# EAGLE design SHIFT_LEFT_RIGHT_1 (EAGLE 6.5.0)

## Sheet 1 of 4
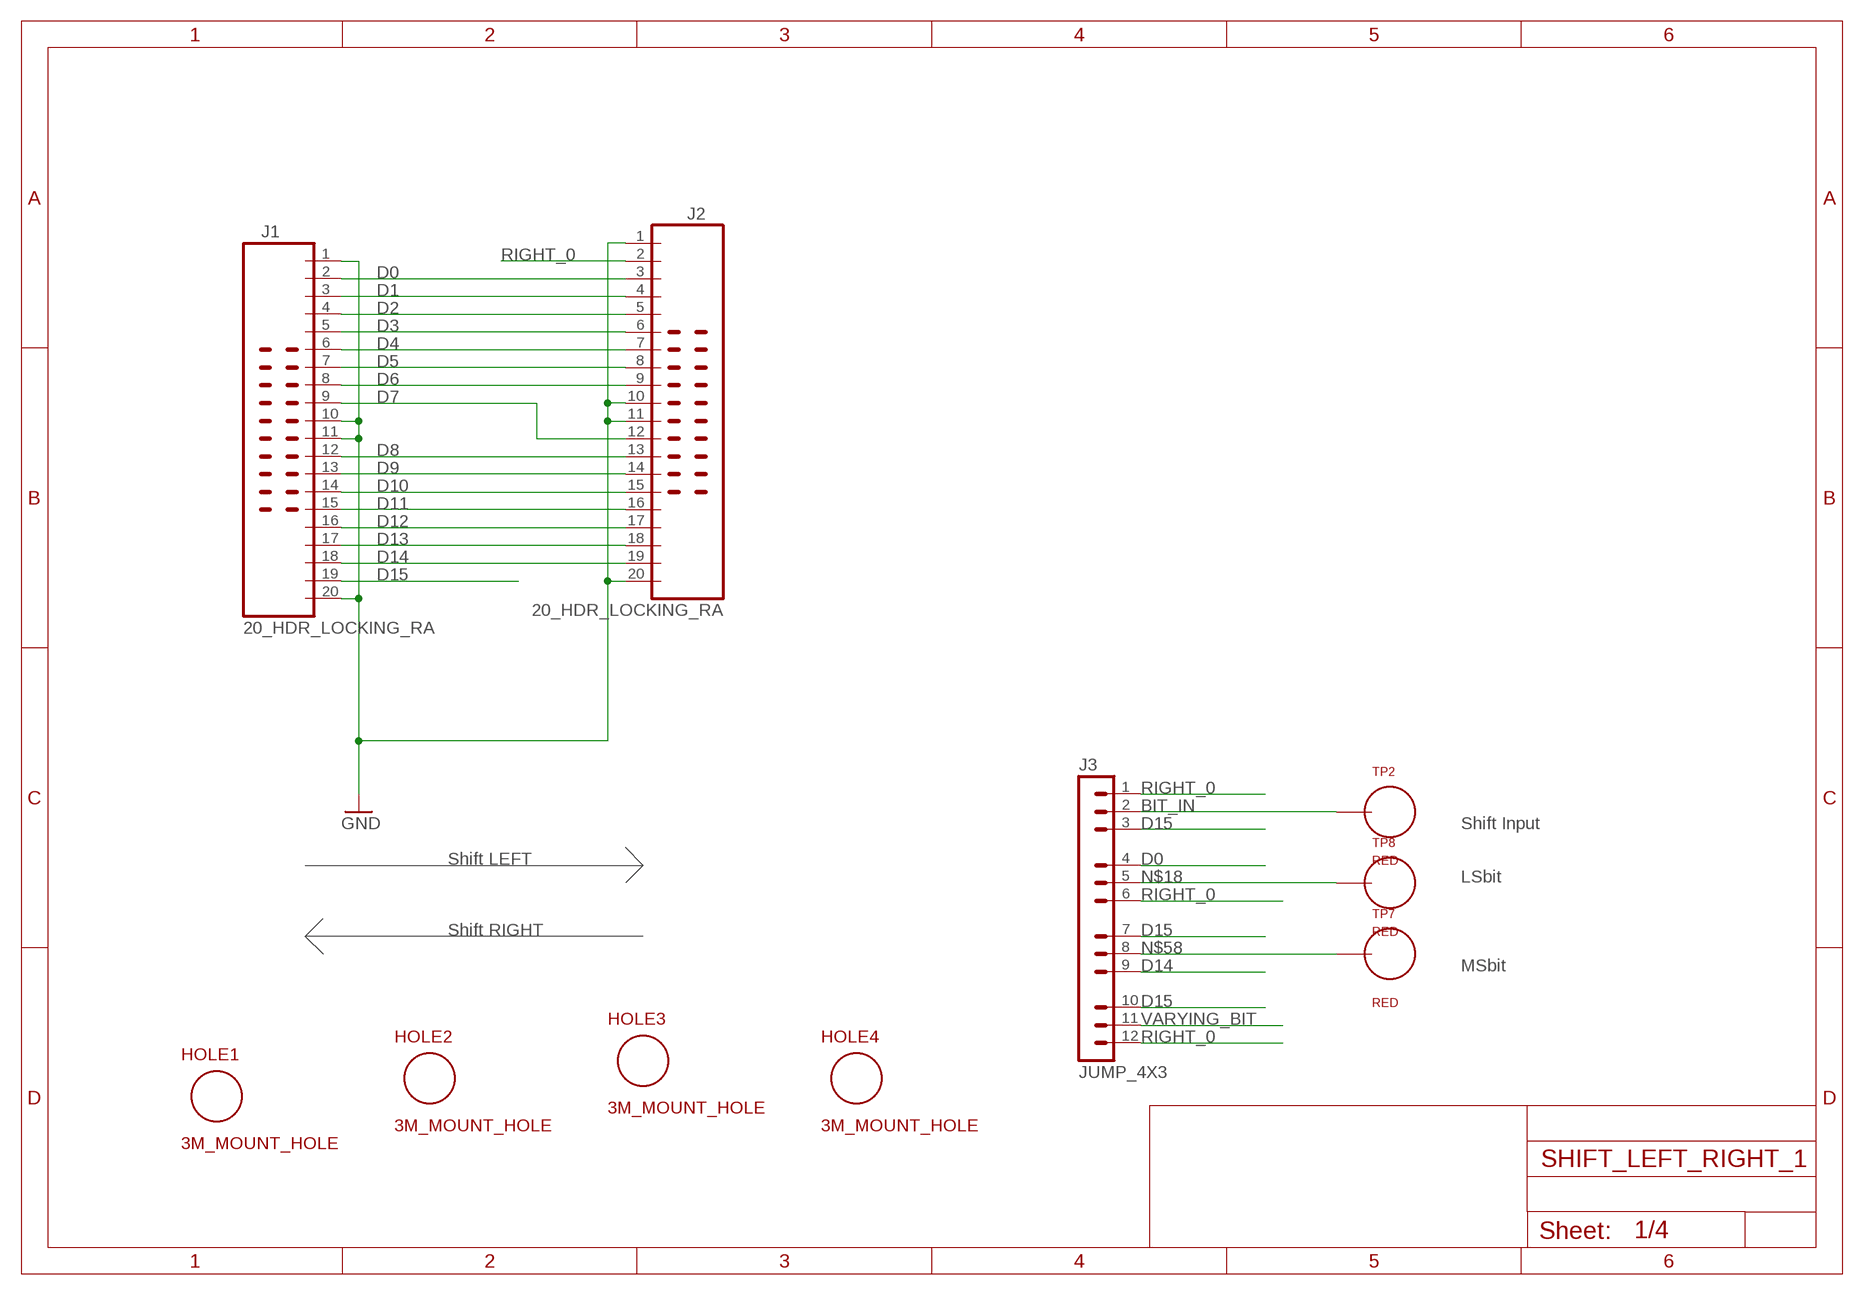
[diagram p0: schematic, sheet 1]

### Parts
HOLE1  3M_MOUNT_HOLE  [3M_HOLE]
HOLE2  3M_MOUNT_HOLE  [3M_HOLE]
HOLE3  3M_MOUNT_HOLE  [3M_HOLE]
HOLE4  3M_MOUNT_HOLE  [3M_HOLE]
J1  20_HDR_LOCKING_RA  [20_HDR_LOCKING_RA]
J2  20_HDR_LOCKING_RA  [20_HDR_LOCKING_RA]
J3  JUMP_4X3  [JUMP_4X3]
TP2  RED  TEST_LOOP  [TEST_LOOP]
TP7  RED  TEST_LOOP  [TEST_LOOP]
TP8  RED  TEST_LOOP  [TEST_LOOP]

### Nets
BIT_IN: J3.2 TP2.P$1 ; also sheet 4
D0: J1.2 J2.3 J3.4 ; also sheet 2
D1: J1.3 J2.4 ; also sheet 2
D2: J1.4 J2.5 ; also sheet 2
D3: J1.5 J2.6 ; also sheet 2
D4: J1.6 J2.7 ; also sheet 2
D5: J1.7 J2.8 ; also sheet 2
D6: J1.8 J2.9 ; also sheet 2
D7: J1.9 J2.12 ; also sheet 2
D8: J1.12 J2.13 ; also sheet 3
D9: J1.13 J2.14 ; also sheet 3
D10: J1.14 J2.15 ; also sheet 3
D11: J1.15 J2.16 ; also sheet 3
D12: J1.16 J2.17 ; also sheet 3
D13: J1.17 J2.18 ; also sheet 3
D14: J1.18 J2.19 J3.9 ; also sheet 3
D15: J1.19 J3.3 J3.7 J3.10 ; also sheet 3
GND: J1.1 J1.10 J1.11 J1.20 J2.1 J2.10 J2.11 J2.20 ; also sheet 2,3,4
N$18: J3.5 TP8.P$1
N$58: J3.8 TP7.P$1
RIGHT_0: J2.2 J3.1 J3.6 J3.12 ; also sheet 2
VARYING_BIT: J3.11 ; also sheet 4

### Notes on the sheet
- Shift Input
- Shift LEFT
- LSbit
- Shift RIGHT
- MSbit

## Sheet 2 of 4
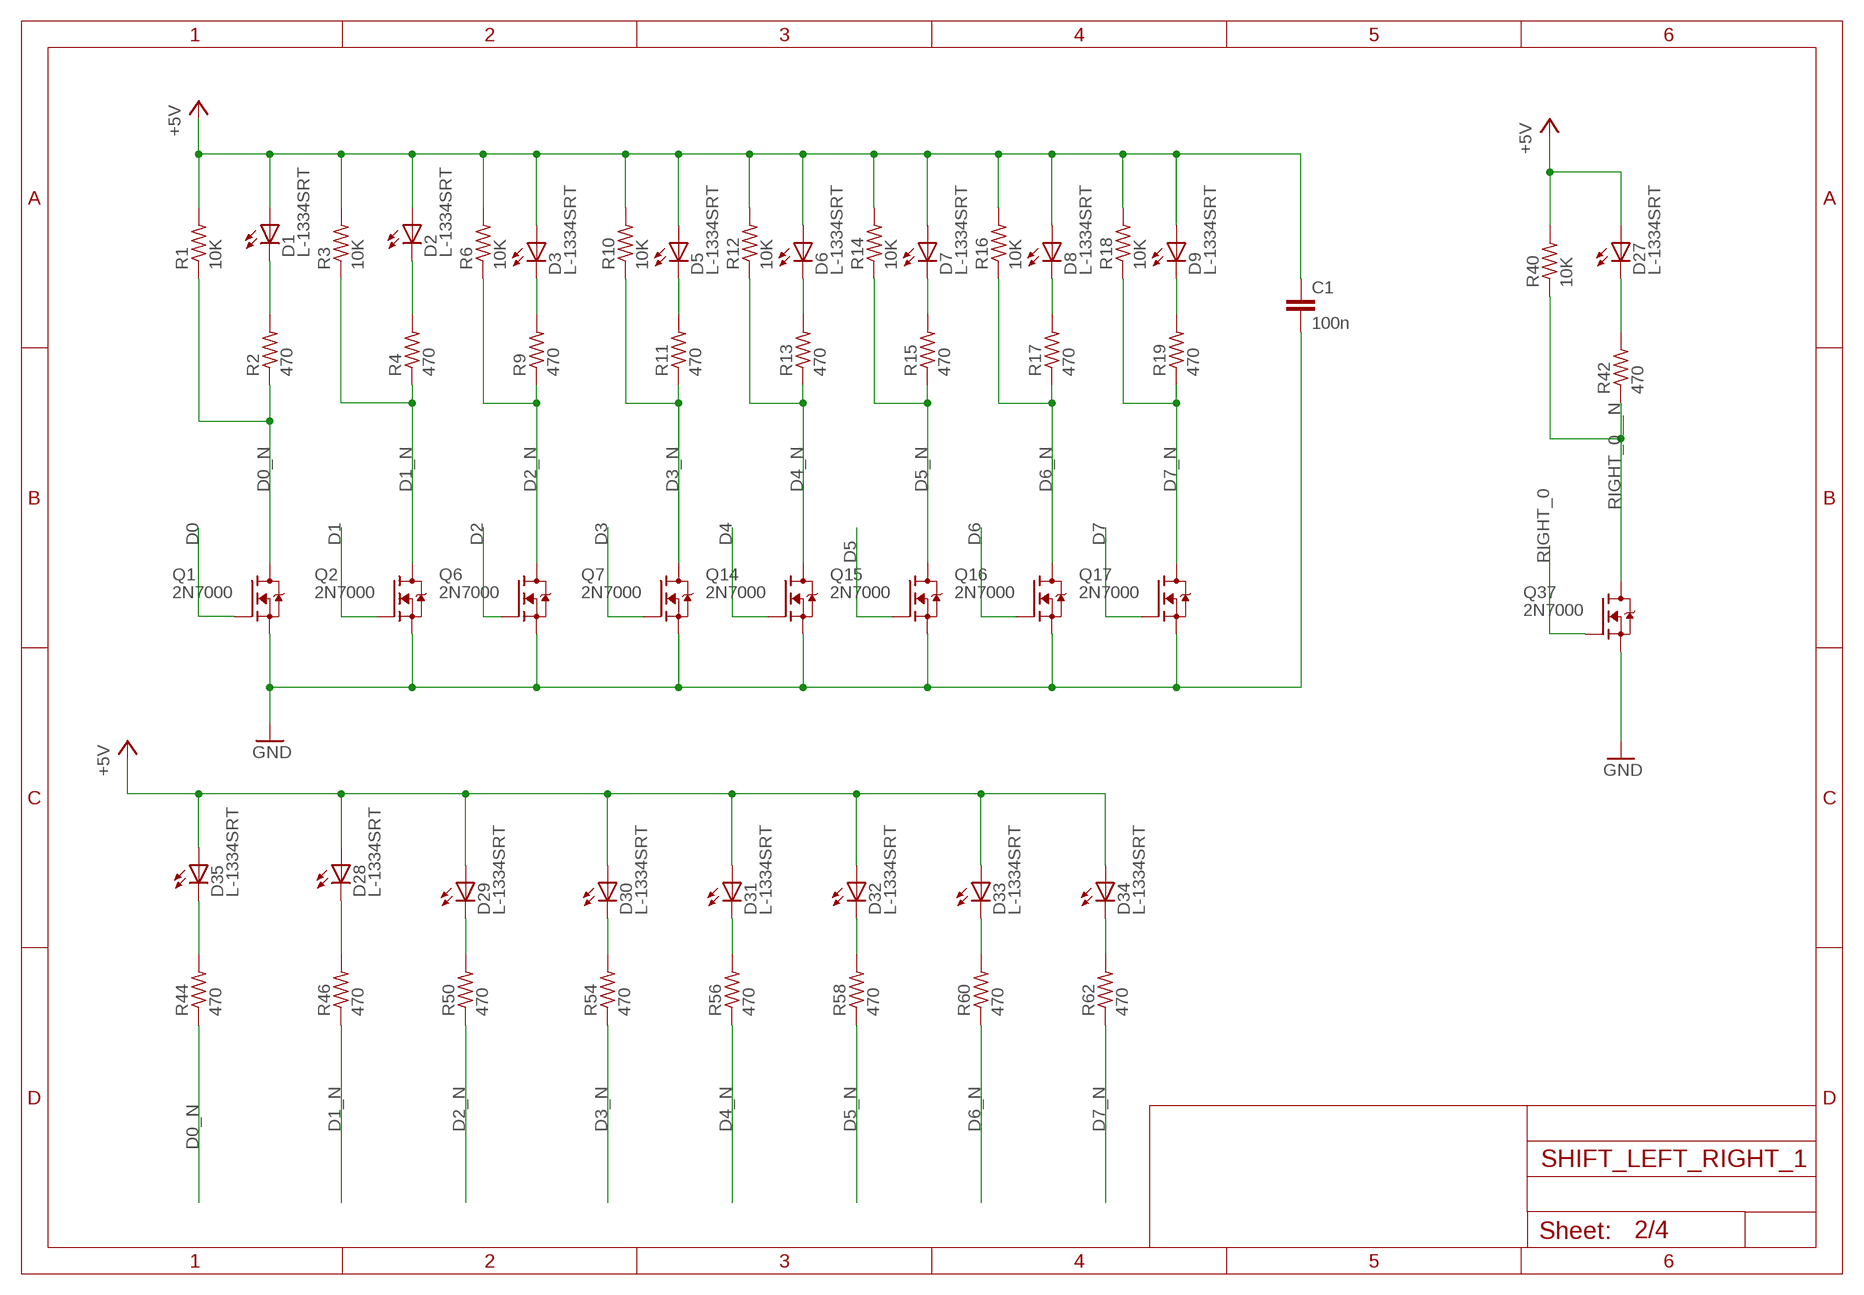
[diagram p1: schematic, sheet 2]

### Parts
C1  100n  C_P2INCH  [CAP_P2INCH]
D1  L-1334SRT  [LED3MM]
D2  L-1334SRT  [LED3MM]
D3  L-1334SRT  [LED3MM]
D5  L-1334SRT  [LED3MM]
D6  L-1334SRT  [LED3MM]
D7  L-1334SRT  [LED3MM]
D8  L-1334SRT  [LED3MM]
D9  L-1334SRT  [LED3MM]
D27  L-1334SRT  [LED3MM]
D28  L-1334SRT  [LED3MM]
D29  L-1334SRT  [LED3MM]
D30  L-1334SRT  [LED3MM]
D31  L-1334SRT  [LED3MM]
D32  L-1334SRT  [LED3MM]
D33  L-1334SRT  [LED3MM]
D34  L-1334SRT  [LED3MM]
D35  L-1334SRT  [LED3MM]
Q1  2N7000  [TO92-DGS]
Q2  2N7000  [TO92-DGS]
Q6  2N7000  [TO92-DGS]
Q7  2N7000  [TO92-DGS]
Q14  2N7000  [TO92-DGS]
Q15  2N7000  [TO92-DGS]
Q16  2N7000  [TO92-DGS]
Q17  2N7000  [TO92-DGS]
Q37  2N7000  [TO92-DGS]
R1  10K  R_P2INCH  [R_P2INCH]
R2  470  R_P2INCH  [R_P2INCH]
R3  10K  R_P2INCH  [R_P2INCH]
R4  470  R_P2INCH  [R_P2INCH]
R6  10K  R_P2INCH  [R_P2INCH]
R9  470  R_P2INCH  [R_P2INCH]
R10  10K  R_P2INCH  [R_P2INCH]
R11  470  R_P2INCH  [R_P2INCH]
R12  10K  R_P2INCH  [R_P2INCH]
R13  470  R_P2INCH  [R_P2INCH]
R14  10K  R_P2INCH  [R_P2INCH]
R15  470  R_P2INCH  [R_P2INCH]
R16  10K  R_P2INCH  [R_P2INCH]
R17  470  R_P2INCH  [R_P2INCH]
R18  10K  R_P2INCH  [R_P2INCH]
R19  470  R_P2INCH  [R_P2INCH]
R40  10K  R_P2INCH  [R_P2INCH]
R42  470  R_P2INCH  [R_P2INCH]
R44  470  R_P2INCH  [R_P2INCH]
R46  470  R_P2INCH  [R_P2INCH]
R50  470  R_P2INCH  [R_P2INCH]
R54  470  R_P2INCH  [R_P2INCH]
R56  470  R_P2INCH  [R_P2INCH]
R58  470  R_P2INCH  [R_P2INCH]
R60  470  R_P2INCH  [R_P2INCH]
R62  470  R_P2INCH  [R_P2INCH]

### Nets
+5V: C1.1 D1.A D2.A D3.A D5.A D6.A D7.A D8.A D9.A D27.A D28.A D29.A D30.A D31.A D32.A D33.A D34.A D35.A R1.2 R3.2 R6.2 R10.2 R12.2 R14.2 R16.2 R18.2 R40.2 ; also sheet 3,4
D0: Q1.G ; also sheet 1
D0_N: Q1.D R1.1 R2.1 R44.1 ; also sheet 4
D1: Q2.G ; also sheet 1
D1_N: Q2.D R3.1 R4.1 R46.1 ; also sheet 4
D2: Q6.G ; also sheet 1
D2_N: Q6.D R6.1 R9.1 R50.1 ; also sheet 4
D3: Q7.G ; also sheet 1
D3_N: Q7.D R10.1 R11.1 R54.1 ; also sheet 4
D4: Q14.G ; also sheet 1
D4_N: Q14.D R12.1 R13.1 R56.1 ; also sheet 4
D5: Q15.G ; also sheet 1
D5_N: Q15.D R14.1 R15.1 R58.1 ; also sheet 4
D6: Q16.G ; also sheet 1
D6_N: Q16.D R16.1 R17.1 R60.1 ; also sheet 4
D7: Q17.G ; also sheet 1
D7_N: Q17.D R18.1 R19.1 R62.1 ; also sheet 4
GND: C1.2 Q1.S Q2.S Q6.S Q7.S Q14.S Q15.S Q16.S Q17.S Q37.S ; also sheet 1,3,4
N$23: D2.K(C) R4.2
N$24: D1.K(C) R2.2
N$26: D28.K(C) R46.2
N$28: D5.K(C) R11.2
N$29: D3.K(C) R9.2
N$30: D27.K(C) R42.2
N$31: D30.K(C) R54.2
N$32: D29.K(C) R50.2
N$35: D6.K(C) R13.2
N$36: D7.K(C) R15.2
N$37: D8.K(C) R17.2
N$38: D9.K(C) R19.2
N$39: D31.K(C) R56.2
N$40: D32.K(C) R58.2
N$41: D33.K(C) R60.2
N$42: D34.K(C) R62.2
N$53: D35.K(C) R44.2
RIGHT_0: Q37.G ; also sheet 1
RIGHT_0__N: Q37.D R40.1 R42.1

## Sheet 3 of 4
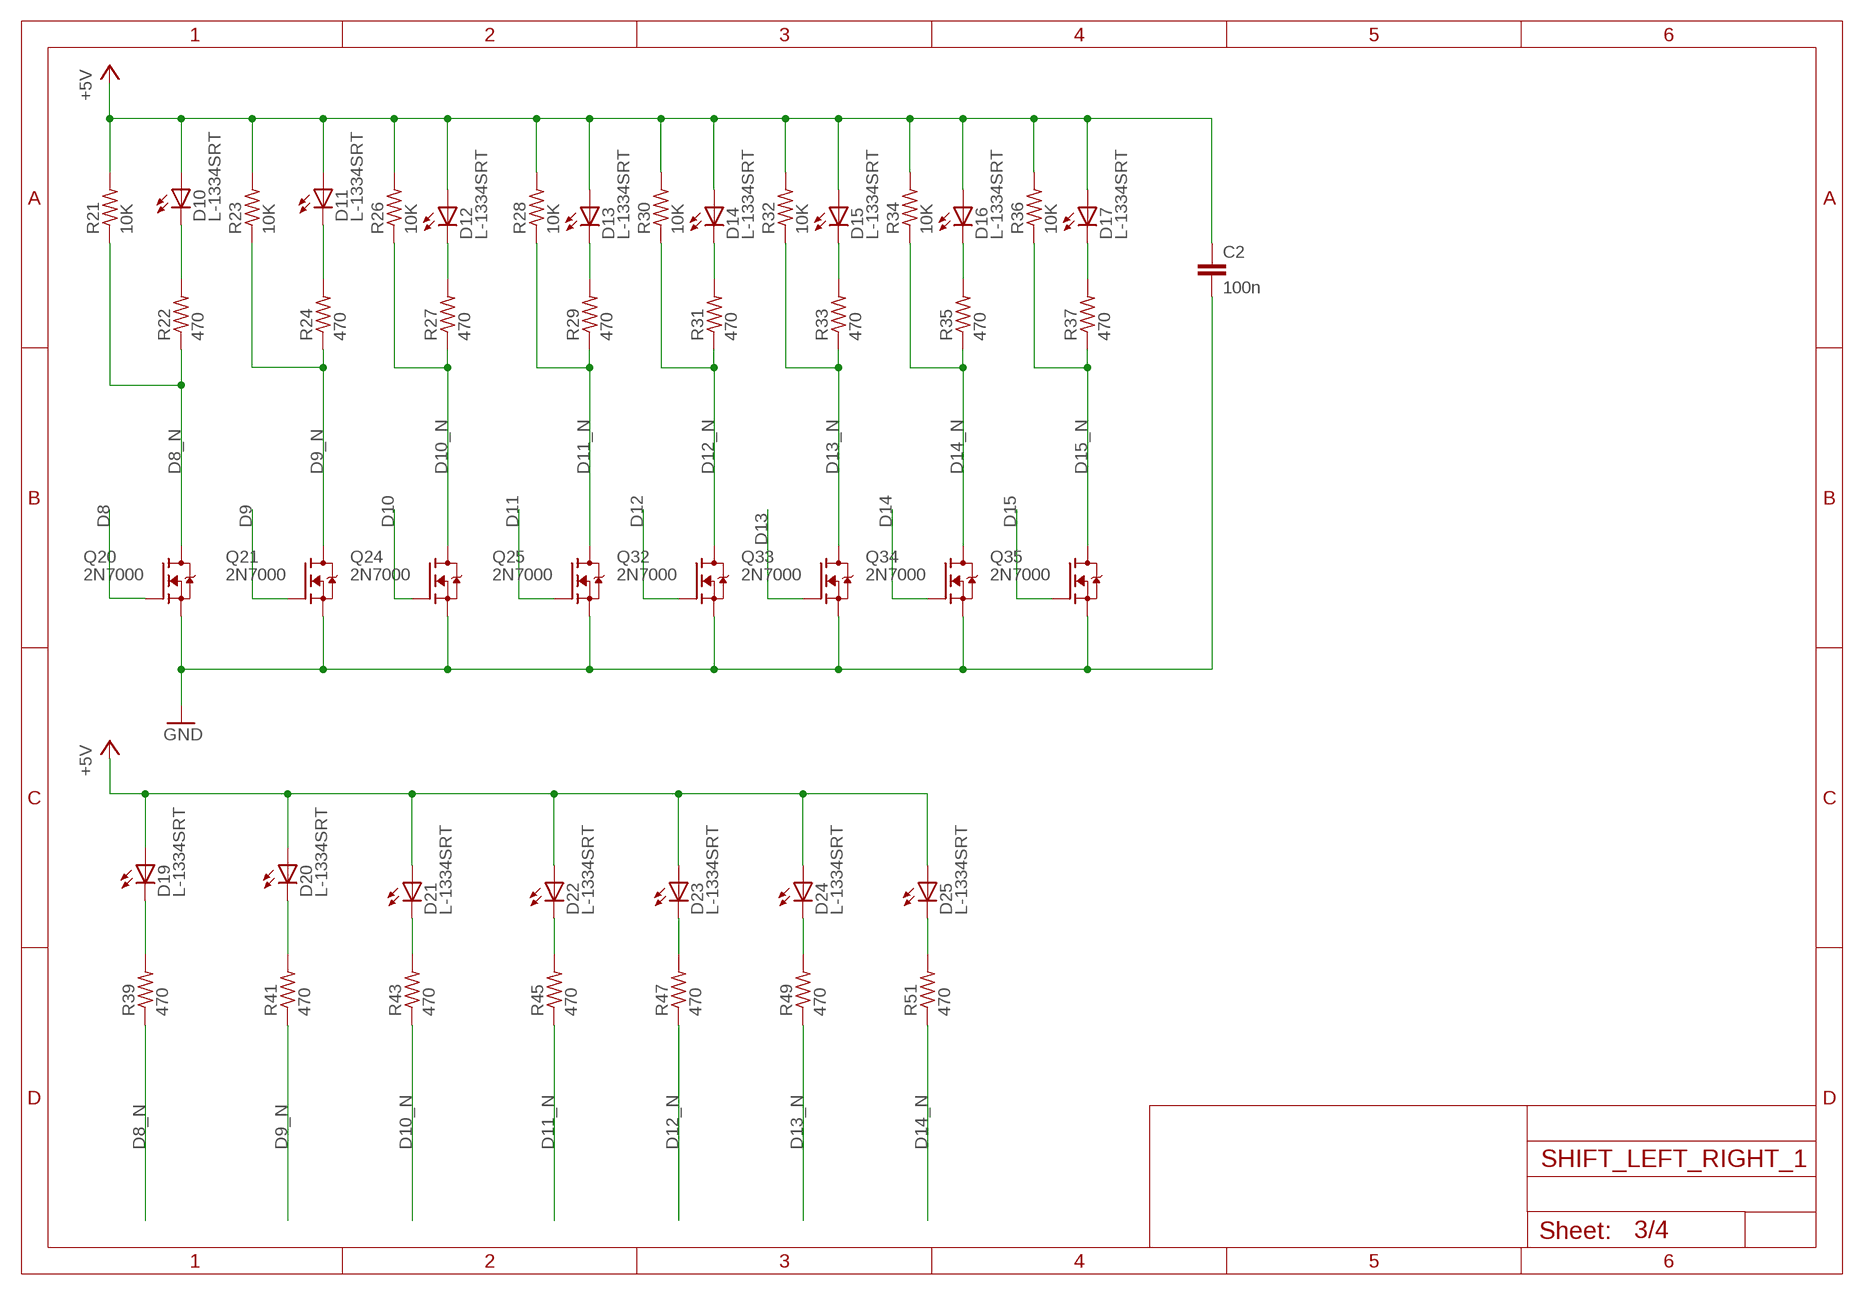
[diagram p2: schematic, sheet 3]

### Parts
C2  100n  C_P2INCH  [CAP_P2INCH]
D10  L-1334SRT  [LED3MM]
D11  L-1334SRT  [LED3MM]
D12  L-1334SRT  [LED3MM]
D13  L-1334SRT  [LED3MM]
D14  L-1334SRT  [LED3MM]
D15  L-1334SRT  [LED3MM]
D16  L-1334SRT  [LED3MM]
D17  L-1334SRT  [LED3MM]
D19  L-1334SRT  [LED3MM]
D20  L-1334SRT  [LED3MM]
D21  L-1334SRT  [LED3MM]
D22  L-1334SRT  [LED3MM]
D23  L-1334SRT  [LED3MM]
D24  L-1334SRT  [LED3MM]
D25  L-1334SRT  [LED3MM]
Q20  2N7000  [TO92-DGS]
Q21  2N7000  [TO92-DGS]
Q24  2N7000  [TO92-DGS]
Q25  2N7000  [TO92-DGS]
Q32  2N7000  [TO92-DGS]
Q33  2N7000  [TO92-DGS]
Q34  2N7000  [TO92-DGS]
Q35  2N7000  [TO92-DGS]
R21  10K  R_P2INCH  [R_P2INCH]
R22  470  R_P2INCH  [R_P2INCH]
R23  10K  R_P2INCH  [R_P2INCH]
R24  470  R_P2INCH  [R_P2INCH]
R26  10K  R_P2INCH  [R_P2INCH]
R27  470  R_P2INCH  [R_P2INCH]
R28  10K  R_P2INCH  [R_P2INCH]
R29  470  R_P2INCH  [R_P2INCH]
R30  10K  R_P2INCH  [R_P2INCH]
R31  470  R_P2INCH  [R_P2INCH]
R32  10K  R_P2INCH  [R_P2INCH]
R33  470  R_P2INCH  [R_P2INCH]
R34  10K  R_P2INCH  [R_P2INCH]
R35  470  R_P2INCH  [R_P2INCH]
R36  10K  R_P2INCH  [R_P2INCH]
R37  470  R_P2INCH  [R_P2INCH]
R39  470  R_P2INCH  [R_P2INCH]
R41  470  R_P2INCH  [R_P2INCH]
R43  470  R_P2INCH  [R_P2INCH]
R45  470  R_P2INCH  [R_P2INCH]
R47  470  R_P2INCH  [R_P2INCH]
R49  470  R_P2INCH  [R_P2INCH]
R51  470  R_P2INCH  [R_P2INCH]

### Nets
+5V: C2.1 D10.A D11.A D12.A D13.A D14.A D15.A D16.A D17.A D19.A D20.A D21.A D22.A D23.A D24.A D25.A R21.2 R23.2 R26.2 R28.2 R30.2 R32.2 R34.2 R36.2 ; also sheet 2,4
D8: Q20.G ; also sheet 1
D8_N: Q20.D R21.1 R22.1 R39.1 ; also sheet 4
D9: Q21.G ; also sheet 1
D9_N: Q21.D R23.1 R24.1 R41.1 ; also sheet 4
D10: Q24.G ; also sheet 1
D10_N: Q24.D R26.1 R27.1 R43.1 ; also sheet 4
D11: Q25.G ; also sheet 1
D11_N: Q25.D R28.1 R29.1 R45.1 ; also sheet 4
D12: Q32.G ; also sheet 1
D12_N: Q32.D R30.1 R31.1 R47.1 ; also sheet 4
D13: Q33.G ; also sheet 1
D13_N: Q33.D R32.1 R33.1 R49.1 ; also sheet 4
D14: Q34.G ; also sheet 1
D14_N: Q34.D R34.1 R35.1 R51.1 ; also sheet 4
D15: Q35.G ; also sheet 1
D15_N: Q35.D R36.1 R37.1
GND: C2.2 Q20.S Q21.S Q24.S Q25.S Q32.S Q33.S Q34.S Q35.S ; also sheet 1,2,4
N$1: D11.K(C) R24.2
N$3: D10.K(C) R22.2
N$4: D20.K(C) R41.2
N$6: D13.K(C) R29.2
N$7: D12.K(C) R27.2
N$8: D19.K(C) R39.2
N$9: D22.K(C) R45.2
N$10: D21.K(C) R43.2
N$13: D14.K(C) R31.2
N$14: D15.K(C) R33.2
N$15: D16.K(C) R35.2
N$16: D17.K(C) R37.2
N$17: D23.K(C) R47.2
N$19: D24.K(C) R49.2
N$20: D25.K(C) R51.2

## Sheet 4 of 4
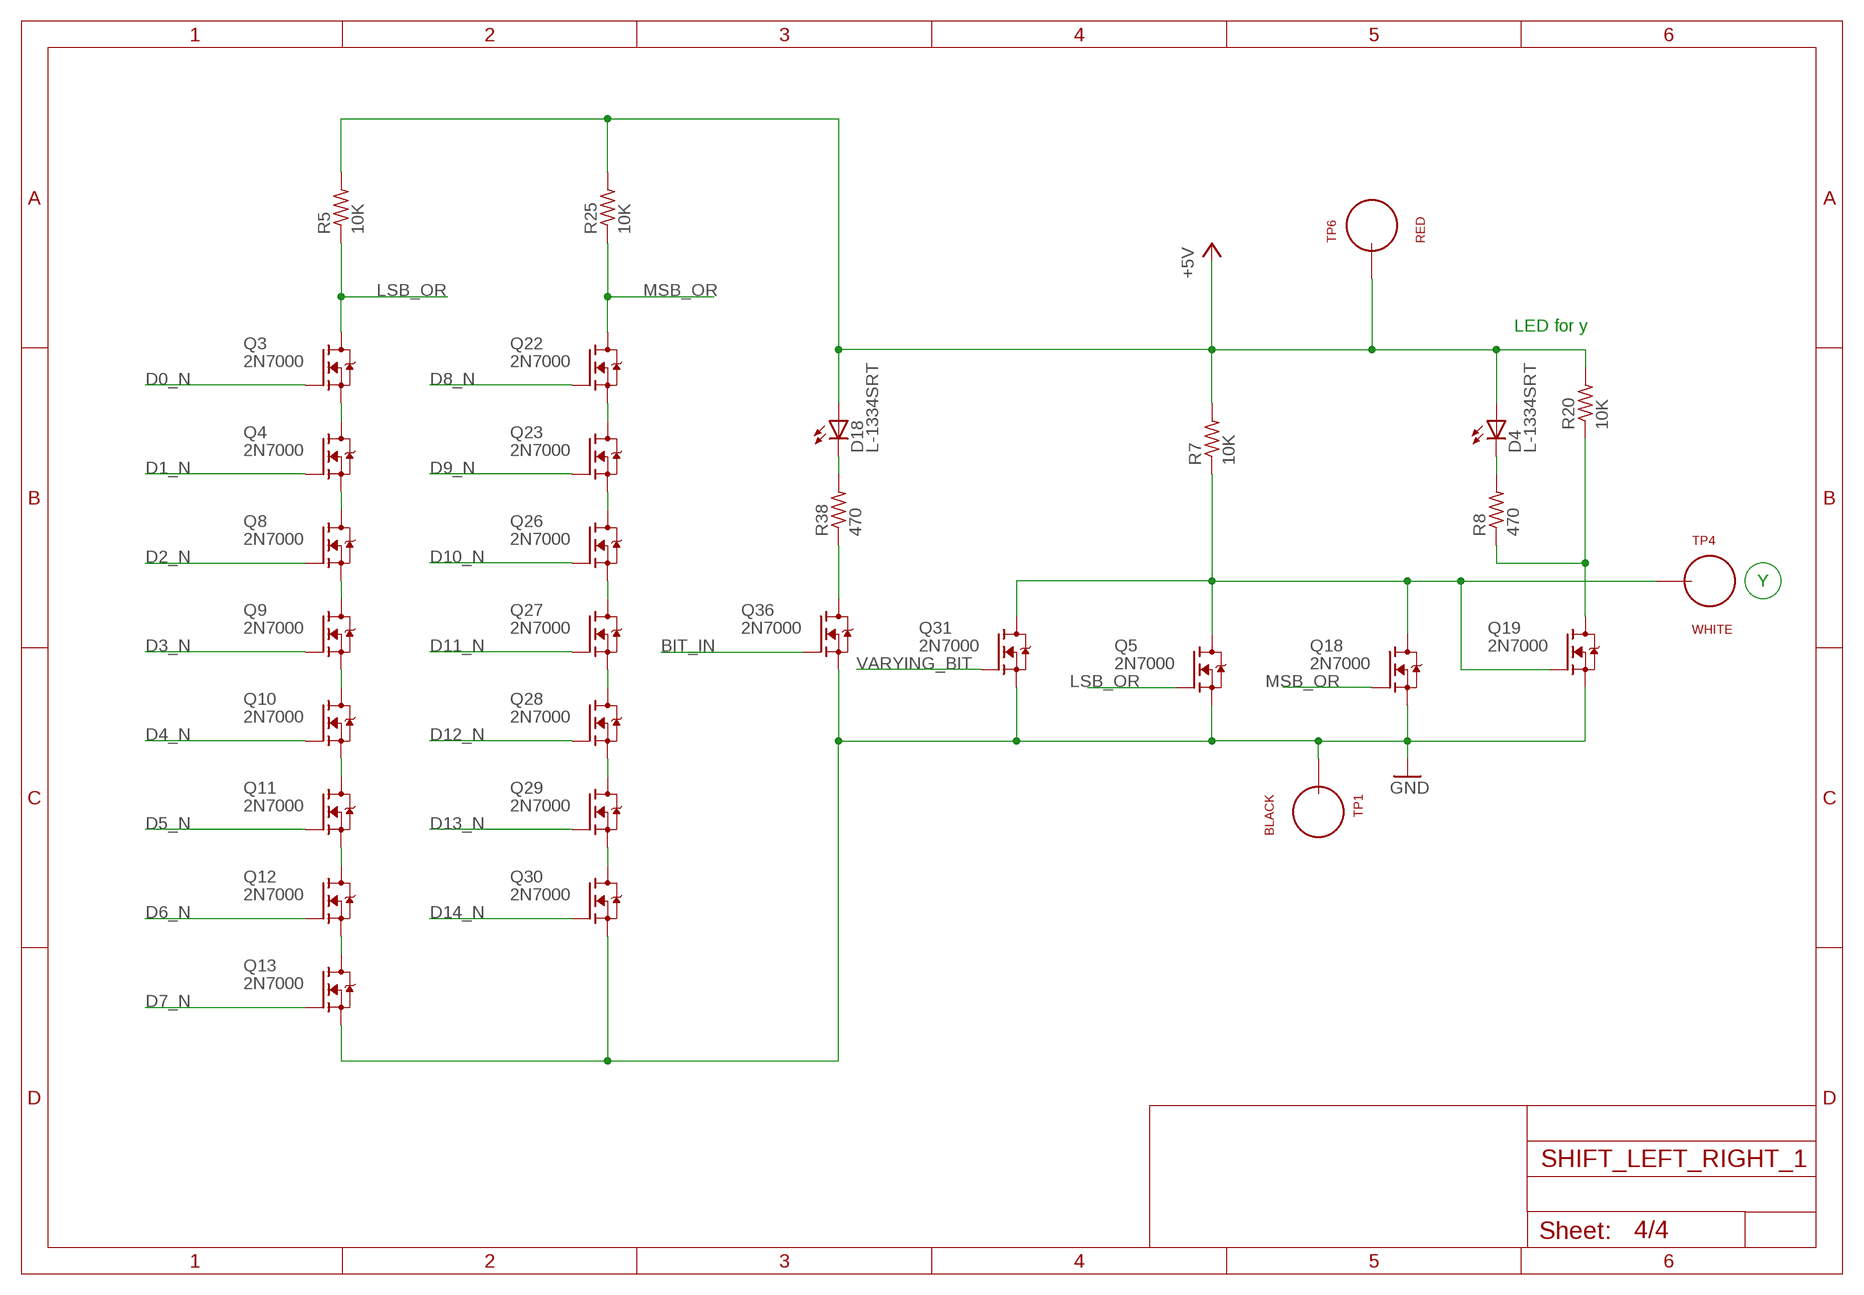
[diagram p3: schematic, sheet 4]

### Parts
D4  L-1334SRT  [LED3MM]
D18  L-1334SRT  [LED3MM]
Q3  2N7000  [TO92-DGS]
Q4  2N7000  [TO92-DGS]
Q5  2N7000  [TO92-DGS]
Q8  2N7000  [TO92-DGS]
Q9  2N7000  [TO92-DGS]
Q10  2N7000  [TO92-DGS]
Q11  2N7000  [TO92-DGS]
Q12  2N7000  [TO92-DGS]
Q13  2N7000  [TO92-DGS]
Q18  2N7000  [TO92-DGS]
Q19  2N7000  [TO92-DGS]
Q22  2N7000  [TO92-DGS]
Q23  2N7000  [TO92-DGS]
Q26  2N7000  [TO92-DGS]
Q27  2N7000  [TO92-DGS]
Q28  2N7000  [TO92-DGS]
Q29  2N7000  [TO92-DGS]
Q30  2N7000  [TO92-DGS]
Q31  2N7000  [TO92-DGS]
Q36  2N7000  [TO92-DGS]
R5  10K  R_P2INCH  [R_P2INCH]
R7  10K  R_P2INCH  [R_P2INCH]
R8  470  R_P2INCH  [R_P2INCH]
R20  10K  R_P2INCH  [R_P2INCH]
R25  10K  R_P2INCH  [R_P2INCH]
R38  470  R_P2INCH  [R_P2INCH]
TP1  BLACK  TEST_LOOP  [TEST_LOOP]
TP4  WHITE  TEST_LOOP  [TEST_LOOP]
TP6  RED  TEST_LOOP  [TEST_LOOP]

### Nets
+5V: D4.A D18.A R5.2 R7.2 R20.2 R25.2 TP6.P$1 ; also sheet 2,3
BIT_IN: Q36.G ; also sheet 1
D0_N: Q3.G ; also sheet 2
D1_N: Q4.G ; also sheet 2
D2_N: Q8.G ; also sheet 2
D3_N: Q9.G ; also sheet 2
D4_N: Q10.G ; also sheet 2
D5_N: Q11.G ; also sheet 2
D6_N: Q12.G ; also sheet 2
D7_N: Q13.G ; also sheet 2
D8_N: Q22.G ; also sheet 3
D9_N: Q23.G ; also sheet 3
D10_N: Q26.G ; also sheet 3
D11_N: Q27.G ; also sheet 3
D12_N: Q28.G ; also sheet 3
D13_N: Q29.G ; also sheet 3
D14_N: Q30.G ; also sheet 3
GND: Q5.S Q13.S Q18.S Q19.S Q30.S Q31.S Q36.S TP1.P$1 ; also sheet 1,2,3
LSB_OR: Q3.D Q5.G R5.1
MSB_OR: Q18.G Q22.D R25.1
N$2: Q19.D R8.1 R20.1
N$5: Q22.S Q23.D
N$11: Q23.S Q26.D
N$12: Q26.S Q27.D
N$21: D4.K(C) R8.2
N$22: Q5.D Q18.D Q19.G Q31.D R7.1 TP4.P$1
N$27: Q3.S Q4.D
N$33: Q4.S Q8.D
N$34: Q8.S Q9.D
N$43: Q9.S Q10.D
N$44: Q10.S Q11.D
N$45: Q11.S Q12.D
N$46: Q12.S Q13.D
N$47: Q27.S Q28.D
N$48: Q28.S Q29.D
N$49: Q29.S Q30.D
N$51: D18.K(C) R38.2
N$52: Q36.D R38.1
VARYING_BIT: Q31.G ; also sheet 1

### Notes on the sheet
- LED for y
- Y

## Library data of the parts
C1 C2 = MyLib:C_P2INCH
D1-D25 D27-D35 = MyLib:L-1334SRT
HOLE1-HOLE4 = MyLib:3M_MOUNT_HOLE
J1 J2 = MyLib:20_HDR_LOCKING_RA
J3 = MyLib:JUMP_4X3
Q1-Q37 = MyLib:2N7000
R1-R47 R49-R51 R54 R56 R58 R60 R62 = MyLib:R_P2INCH
TP1 TP2 TP4 TP6-TP8 = MyLib:TEST_LOOP

## Board
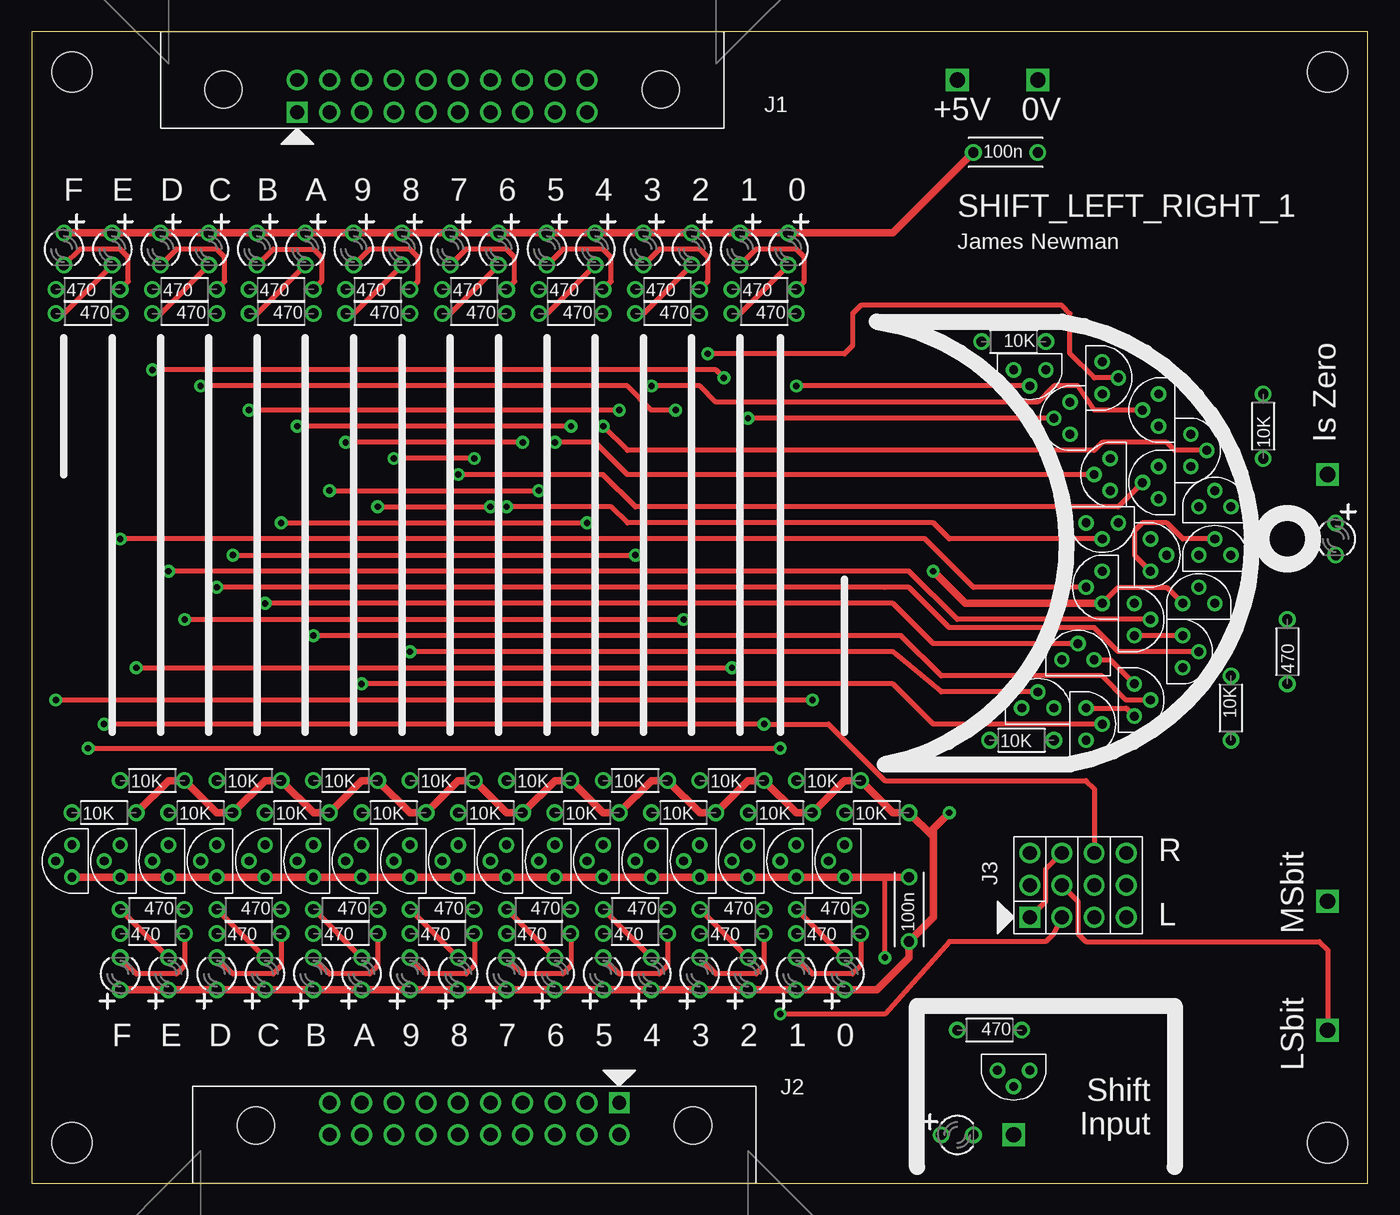
[diagram p4: board, top side]
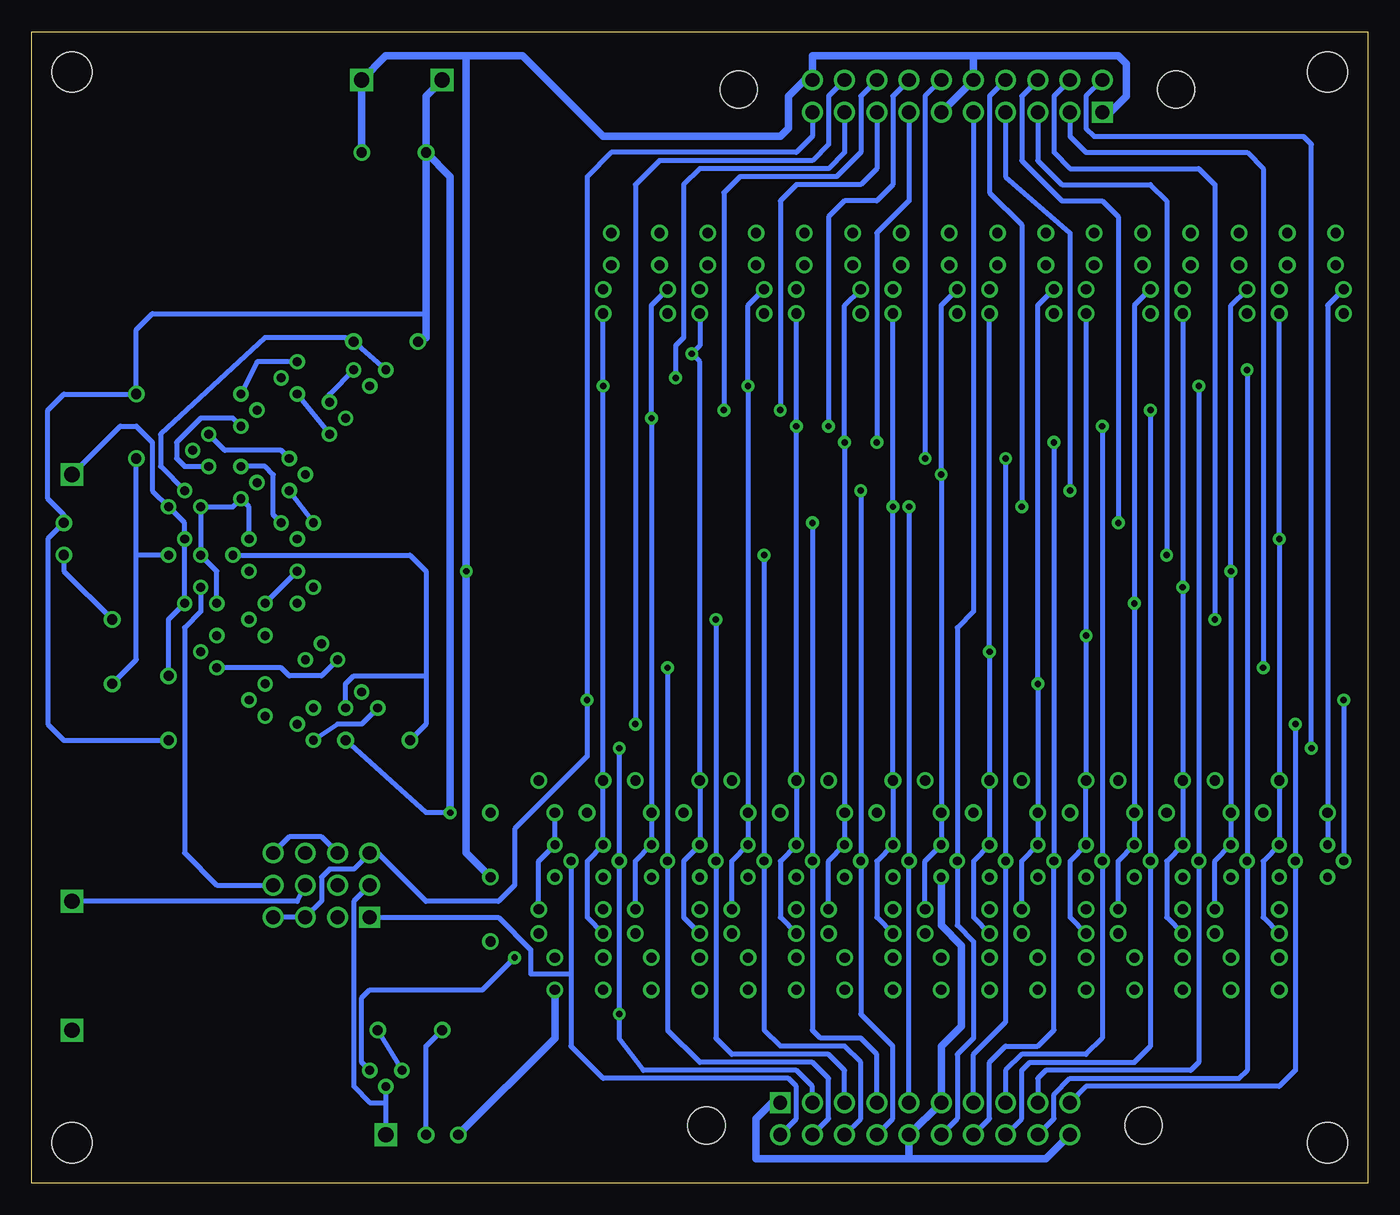
[diagram p5: board, bottom side, seen from below]

Size 105.41 x 90.81 mm. Coordinates in mm from the lower left corner, seen from the top.
Outline: 0,0 105.41,0 105.41,90.81 0,90.81 0,0
Copper layers (1*16): Top 0.035mm / dielectric 1.5mm / Bottom 0.035mm
Design rules "processor_rules_2layer": minimum track width 8mil, minimum drill 14mil, track to track 8mil, track to pad 8mil, pad to pad 8mil, via to via 8mil, smd to smd 8mil, copper to edge 40mil, drill to drill 8mil, minimum pad ring 10mil, minimum via ring 8mil, stop-mask expansion 4mil, vias tented up to drill 0.7mm, thermal gap 10mil

### Footprints (pad centres in the part's own frame; a part is rotated, then mirrored left to right if it is on the bottom)
CAP_P2INCH = drill 0.8: 1 -2.54,0; 2 2.54,0
LED3MM = drill 0.8: A -1.27,0; K 1.27,0
3M_HOLE = hole 3.2: 0,0
20_HDR_LOCKING_RA = drill 1.1 square: 1 -11.43,-1.27 | drill 1.1: 2 -11.43,1.27; 3 -8.89,-1.27; 4 -8.89,1.27; 5 -6.35,-1.27; 6 -6.35,1.27; 7 -3.81,-1.27; 8 -3.81,1.27; 9 -1.27,-1.27; 10 -1.27,1.27; 11 1.27,-1.27; 12 1.27,1.27; 13 3.81,-1.27; 14 3.81,1.27; 15 6.35,-1.27; 16 6.35,1.27; 17 8.89,-1.27; 18 8.89,1.27; 19 11.43,-1.27; 20 11.43,1.27 | hole 2.946: -17.247,0.533; 17.247,0.533
JUMP_4X3 = drill 1.1 square: 1 -2.54,3.81 | drill 1.1: 2 0,3.81; 3 2.54,3.81; 4 -2.54,1.27; 5 0,1.27; 6 2.54,1.27; 7 -2.54,-1.27; 8 0,-1.27; 9 2.54,-1.27; 10 -2.54,-3.81; 11 0,-3.81; 12 2.54,-3.81
TO92-DGS = drill 0.7: D 0,1.27; G -1.27,0; S 0,-1.27
R_P2INCH = drill 0.8: 1 -2.54,0; 2 2.54,0
TEST_LOOP = drill 1.2 square: P$1 0,0

### Placement (x,y rotation side)
C1  69.22,21.59 90 top
C2  76.83,81.28 0 top
D1  60.33,16.51 90 top
D2  56.52,16.51 90 top
D3  52.7,16.51 90 top
D4  102.87,50.8 270 top
D5  48.9,16.51 90 top
D6  45.09,16.51 90 top
D7  41.27,16.51 90 top
D8  37.47,16.51 90 top
D9  33.66,16.51 90 top
D10  29.84,16.51 90 top
D11  26.04,16.51 90 top
D12  22.23,16.51 90 top
D13  18.41,16.51 90 top
D14  14.61,16.51 90 top
D15  10.79,16.51 90 top
D16  6.99,16.51 90 top
D17  2.54,73.66 270 top
D18  73.03,3.81 0 top
D19  29.21,73.66 270 top
D20  25.4,73.66 270 top
D21  21.59,73.66 270 top
D22  17.78,73.66 270 top
D23  13.97,73.66 270 top
D24  10.16,73.66 270 top
D25  6.35,73.66 270 top
D27  64.14,16.51 90 top
D28  55.88,73.66 270 top
D29  52.07,73.66 270 top
D30  48.26,73.66 270 top
D31  44.45,73.66 270 top
D32  40.64,73.66 270 top
D33  36.83,73.66 270 top
D34  33.02,73.66 270 top
D35  59.69,73.66 270 top
HOLE1  3.17,87.63 0 top
HOLE2  3.17,3.17 0 top
HOLE3  102.23,87.63 0 top
HOLE4  102.23,3.17 0 top
J1  32.38,85.72 0 top
J2  34.92,5.08 180 top
J3  82.55,23.5 90 top
Q1  60.33,25.4 0 top
Q2  56.52,25.4 0 top
Q3  78.74,64.14 90 top
Q4  81.92,60.33 0 top
Q5  93.34,53.34 270 top
Q6  52.7,25.4 0 top
Q7  48.9,25.4 0 top
Q8  84.45,63.5 180 top
Q9  88.9,60.96 0 top
Q10  91.44,57.78 180 top
Q11  85.09,55.88 0 top
Q12  84.45,52.07 90 top
Q13  88.9,55.24 0 top
Q14  45.09,25.4 0 top
Q15  41.27,25.4 0 top
Q16  37.47,25.4 0 top
Q17  33.66,25.4 0 top
Q18  88.27,49.53 180 top
Q19  93.34,49.53 270 top
Q20  29.84,25.4 0 top
Q21  26.04,25.4 0 top
Q22  79.38,37.47 270 top
Q23  83.19,36.2 180 top
Q24  22.23,25.4 0 top
Q25  18.41,25.4 0 top
Q26  87,38.1 180 top
Q27  82.55,41.27 270 top
Q28  90.81,41.91 180 top
Q29  87,44.45 180 top
Q30  84.45,46.99 0 top
Q31  92.08,45.72 270 top
Q32  14.61,25.4 0 top
Q33  10.79,25.4 0 top
Q34  6.99,25.4 0 top
Q35  3.17,25.4 0 top
Q36  77.47,8.89 90 top
Q37  64.14,25.4 0 top
R1  62.87,31.75 0 top
R2  62.87,19.68 0 top
R3  59.05,29.21 0 top
R4  55.24,21.59 180 top
R5  77.47,66.36 180 top
R6  55.24,31.75 0 top
R7  94.61,37.47 270 top
R8  99.06,41.91 90 top
R9  55.24,19.68 0 top
R10  51.44,29.21 0 top
R11  47.62,21.59 180 top
R12  47.62,31.75 0 top
R13  47.62,19.68 0 top
R14  43.81,29.21 0 top
R15  40.01,21.59 180 top
R16  40.01,31.75 0 top
R17  40.01,19.68 0 top
R18  36.2,29.21 0 top
R19  32.38,21.59 180 top
R20  97.16,59.69 90 top
R21  32.38,31.75 0 top
R22  32.38,19.68 0 top
R23  28.57,29.21 0 top
R24  24.77,21.59 180 top
R25  78.11,34.92 0 top
R26  24.77,31.75 0 top
R27  24.77,19.68 0 top
R28  20.95,29.21 0 top
R29  17.14,21.59 180 top
R30  17.14,31.75 0 top
R31  17.14,19.68 0 top
R32  13.34,29.21 0 top
R33  9.53,21.59 180 top
R34  9.53,31.75 0 top
R35  9.53,19.68 0 top
R36  5.71,29.21 0 top
R37  4.45,70.48 0 top
R38  75.56,12.06 180 top
R39  27.3,68.58 180 top
R40  66.67,29.21 0 top
R41  27.3,70.48 0 top
R42  62.87,21.59 180 top
R43  19.68,68.58 180 top
R44  57.78,68.58 180 top
R45  19.68,70.48 0 top
R46  57.78,70.48 0 top
R47  12.06,68.58 180 top
R49  12.06,70.48 0 top
R50  50.16,68.58 180 top
R51  4.45,68.58 180 top
R54  50.16,70.48 0 top
R56  42.55,68.58 180 top
R58  42.55,70.48 0 top
R60  34.92,68.58 180 top
R62  34.92,70.48 0 top
TP1  79.38,87 0 top
TP2  77.47,3.81 180 top
TP4  102.23,55.88 0 top
TP6  73.03,87 0 top
TP7  102.23,22.23 0 top
TP8  102.23,12.06 0 top

### Tracks (layer width: path | path; a pad name or v marks a point on that pad's centre or on a via)
+5V  (via drill 0.5 pad 1.02)
  Top 0.61: R36.2 10.79,31.75 R34.2 14.61,29.21 R32.2 18.41,31.75 R30.2 22.23,29.21 R28.2 26.04,31.75 R26.2 29.84,29.21 R23.2 33.66,31.75 R21.2 37.47,29.21 R18.2 41.27,31.75 R16.2 45.09,29.21 R14.2 48.9,31.75 R12.2 52.7,29.21 R10.2 56.52,31.75 R6.2 60.33,29.21 R3.2 64.14,31.75 R1.2 67.94,29.21 R40.2 71.12,27.3 | D16.A D15.A D14.A D13.A D12.A D11.A D10.A D9.A D8.A D7.A D6.A D5.A D3.A D2.A D1.A D27.A 66.67,15.24 69.22,17.78 C1.1 71.12,20.95 71.12,27.3 | D17.A D25.A D24.A D23.A D22.A D21.A D20.A D19.A D34.A D33.A D32.A D31.A D30.A D29.A D28.A D35.A 67.94,74.93 C2.1 | 71.12,27.3 71.12,27.94 v72.39,29.21
  Bottom 0.406: 74.3,68.58 95.89,68.58 97.16,67.31 R20.2 102.87,62.23 104.14,60.96 104.14,53.98 102.87,52.7 D4.A 104.14,50.8 104.14,36.2 102.87,34.92 R7.2 | v72.39,29.21 74.3,29.21 R25.2
  Bottom 0.61: D27.A 64.14,11.43 D18.A | C2.1 74.3,85.72 TP6.P$1 | C2.1 74.3,68.58 74.3,66.67 R5.2 | v72.39,29.21 72.39,79.38 C2.1
BIT_IN
  Bottom 0.406: Q36.G 77.47,6.35 | 77.47,6.35 TP2.P$1 | J3.2 80.01,22.23 80.01,7.62 78.74,6.35 77.47,6.35
D0  (via drill 0.5 pad 1.02)
  Top 0.406: v4.45,34.29 v59.05,34.29 | J3.4 80.64,19.68 80.01,19.05 72.39,19.05 67.31,13.34 v59.05,13.34
  Bottom 0.406: J2.3 43.81,7.62 45.09,8.89 57.15,8.89 59.05,11.43 v59.05,13.34 Q1.G v59.05,34.29 | J1.2 22.23,85.72 22.23,83.19 21.59,82.55 5.08,82.55 4.45,81.92 v4.45,34.29
D0_N  (via drill 0.5 pad 1.02)
  Top 0.406: Q3.G v60.33,62.87
  Bottom 0.406: R2.1 61.59,20.95 61.59,25.4 Q1.D R1.1 v60.33,62.87 R44.1
D1  (via drill 0.5 pad 1.02)
  Top 0.406: v8.26,40.64 v55.24,40.64
  Bottom 0.406: J2.4 42.55,5.08 42.55,8.26 43.81,9.53 52.7,9.53 55.24,12.06 Q2.G v55.24,40.64 | J1.3 23.5,82.55 22.23,81.28 9.53,81.28 8.26,80.01 v8.26,40.64
D1_N  (via drill 0.5 pad 1.02)
  Top 0.406: Q4.G v56.52,60.33
  Bottom 0.406: R46.1 56.52,69.22 v56.52,60.33 R3.1 Q2.D 57.78,25.4 R4.1
D2  (via drill 0.5 pad 1.02)
  Top 0.406: v12.06,44.45 v51.44,44.45
  Bottom 0.406: J2.5 41.27,8.89 42.55,10.16 50.16,10.16 51.44,11.43 Q6.G v51.44,44.45 | J1.4 24.77,85.72 24.77,81.28 23.5,80.01 13.34,80.01 12.06,78.74 v12.06,44.45
D2_N  (via drill 0.5 pad 1.02)
  Top 0.406: Q8.G 83.82,63.5 81.92,65.41 81.92,68.58 81.28,69.22 65.41,69.22 64.77,68.58 64.77,66.04 64.14,65.41 v53.34,65.41
  Bottom 0.406: R50.1 52.7,66.04 v53.34,65.41 52.7,64.77 R6.1 Q6.D 53.98,25.4 53.98,20.95 R9.1
D3  (via drill 0.5 pad 1.02)
  Top 0.406: v15.88,49.53 v47.62,49.53
  Bottom 0.406: J2.6 40.01,5.08 40.01,9.53 41.27,10.79 46.35,10.79 47.62,12.06 Q7.G v47.62,49.53 | J1.5 26.04,80.64 24.13,78.74 17.14,78.74 15.88,77.47 v15.88,49.53
D3_N  (via drill 0.5 pad 1.02)
  Top 0.406: Q9.G 83.82,60.96 82.55,62.87 80.64,62.87 79.38,61.59 53.98,61.59 52.7,62.87 v48.9,62.87
  Bottom 0.406: R54.1 48.9,69.22 v48.9,62.87 R10.1 Q7.D 50.16,25.4 R11.1
D4  (via drill 0.5 pad 1.02)
  Top 0.406: v19.68,52.07 v43.81,52.07
  Bottom 0.406: J2.7 38.73,10.16 40.01,11.43 43.18,11.43 43.81,12.06 Q14.G v43.81,52.07 | J1.6 27.3,85.72 27.3,80.64 24.13,77.47 20.95,77.47 19.68,76.2 v19.68,52.07
D4_N  (via drill 0.5 pad 1.02)
  Top 0.406: Q10.G 90.17,57.78 89.53,58.42 84.45,58.42 83.82,57.78 46.99,57.78 v45.09,59.69
  Bottom 0.406: R56.1 v45.09,59.69 R12.1 Q14.D 46.35,25.4 46.35,20.95 R13.1
D5  (via drill 0.5 pad 1.02)
  Top 0.406: v23.5,54.61 v40.01,54.61
  Bottom 0.406: J2.8 37.47,5.08 37.47,10.79 40.01,13.34 Q15.G v40.01,54.61 | J1.7 28.57,79.38 23.5,74.93 v23.5,54.61
D5_N  (via drill 0.5 pad 1.02)
  Top 0.406: Q11.G 46.99,55.88 44.45,58.42 v41.27,58.42
  Bottom 0.406: R58.1 41.27,69.22 v41.27,58.42 R14.1 Q15.D 42.55,25.4 R15.1
D6  (via drill 0.5 pad 1.02)
  Top 0.406: v27.3,53.34 v36.2,53.34
  Bottom 0.406: J2.9 Q16.G v36.2,53.34 | J1.8 29.84,85.72 29.84,78.11 27.3,75.56 v27.3,53.34
D6_N  (via drill 0.5 pad 1.02)
  Top 0.406: Q12.G 72.39,50.8 71.12,52.07 46.99,52.07 45.72,53.34 v37.47,53.34
  Bottom 0.406: R60.1 v37.47,53.34 R16.1 Q16.D 38.73,25.4 38.73,20.95 R17.1
D7
  Bottom 0.406: J2.12 32.38,5.08 32.38,10.16 31.11,11.43 31.11,19.05 32.38,20.32 Q17.G 32.38,43.81 31.11,45.09 J1.9
D7_N  (via drill 0.5 pad 1.02)
  Top 0.406: Q13.G 85.72,53.34 47.62,53.34 45.09,55.88 v33.66,55.88
  Bottom 0.406: R62.1 33.66,69.22 v33.66,55.88 R18.1 Q17.D 34.92,25.4 R19.1
D8  (via drill 0.5 pad 1.02)
  Top 0.406: v34.92,57.15 v28.57,57.15
  Bottom 0.406: J2.13 31.11,10.16 28.57,12.7 Q20.G v28.57,57.15 | J1.12 34.92,85.72 v34.92,57.15
D8_N  (via drill 0.5 pad 1.02)
  Top 0.406: Q22.G 71.75,38.73 67.94,41.91 v29.84,41.91
  Bottom 0.406: R39.1 v29.84,41.91 R21.1 Q20.D 31.11,25.4 31.11,20.95 R22.1
D9  (via drill 0.5 pad 1.02)
  Top 0.406: v38.73,58.42 v24.77,58.42
  Bottom 0.406: J2.14 29.84,5.08 29.84,9.53 28.57,10.79 26.04,10.79 24.77,12.06 Q21.G v24.77,58.42 | J1.13 36.2,77.47 38.73,74.93 v38.73,58.42
D9_N  (via drill 0.5 pad 1.02)
  Top 0.406: Q23.G 71.12,36.2 67.94,39.37 v26.04,39.37
  Bottom 0.406: R41.1 26.04,69.22 v26.04,39.37 R23.1 Q21.D 27.3,25.4 R24.1
D10  (via drill 0.5 pad 1.02)
  Top 0.406: v42.55,59.69 v20.95,59.69
  Bottom 0.406: J2.15 28.57,8.89 27.3,10.16 22.23,10.16 20.95,11.43 Q24.G v20.95,59.69 | J1.14 37.47,85.72 37.47,78.74 38.73,77.47 41.27,77.47 42.55,76.2 v42.55,59.69
D10_N  (via drill 0.5 pad 1.02)
  Top 0.406: Q26.G 86.36,38.1 84.45,40.01 71.75,40.01 68.58,43.18 v22.23,43.18
  Bottom 0.406: R43.1 v22.23,43.18 R26.1 Q24.D 23.5,25.4 23.5,20.95 R27.1
D11  (via drill 0.5 pad 1.02)
  Top 0.406: v46.35,60.96 v17.14,60.96
  Bottom 0.406: J2.16 27.3,5.08 27.3,8.89 26.67,9.53 18.41,9.53 17.14,10.79 Q25.G v17.14,60.96 | J1.15 38.73,80.01 40.01,78.74 45.09,78.74 46.35,77.47 v46.35,60.96
D11_N  (via drill 0.5 pad 1.02)
  Top 0.406: Q27.G 71.12,42.55 67.94,45.72 v18.41,45.72
  Bottom 0.406: R45.1 18.41,69.22 v18.41,45.72 R28.1 Q25.D 19.68,25.4 R29.1
D12  (via drill 0.5 pad 1.02)
  Top 0.406: v50.8,60.96 48.9,60.96 46.99,62.87 v13.34,62.87
  Bottom 0.406: J2.17 26.04,8.26 25.4,8.89 13.97,8.89 13.34,9.53 Q32.G v13.34,62.87 | J1.16 40.01,85.72 40.01,81.28 41.91,79.38 49.53,79.38 50.8,78.11 v50.8,60.96
D12_N  (via drill 0.5 pad 1.02)
  Top 0.406: Q28.G 85.72,41.91 83.82,43.81 72.39,43.81 69.22,46.99 67.31,46.99 v14.61,46.99
  Bottom 0.406: R47.1 v14.61,46.99 R30.1 Q32.D 15.88,25.4 15.88,20.95 R31.1
D13  (via drill 0.5 pad 1.02)
  Top 0.406: v54.61,63.5 53.98,64.14 v9.53,64.14
  Bottom 0.406: J2.18 24.77,5.08 24.77,6.99 23.5,8.26 10.16,8.26 9.53,8.89 Q33.G v9.53,64.14 | J1.17 41.27,81.28 42.55,80.01 52.7,80.01 53.98,78.74 53.98,66.67 54.61,66.04 v54.61,63.5
D13_N  (via drill 0.5 pad 1.02)
  Top 0.406: Q29.G 73.03,44.45 69.22,48.26 v10.79,48.26
  Bottom 0.406: R49.1 10.79,69.22 v10.79,48.26 R32.1 Q33.D 12.06,25.4 R33.1
D14  (via drill 0.5 pad 1.02)
  Top 0.406: v5.71,36.2 v57.78,36.2 62.87,36.2 67.31,31.75 83.19,31.75 83.82,31.11 J3.9
  Bottom 0.406: J2.19 22.23,7.62 6.99,7.62 5.71,8.89 Q34.G v5.71,36.2 | J1.18 42.55,85.72 42.55,81.92 43.81,80.64 55.88,80.64 57.78,78.74 v57.78,36.2
D14_N  (via drill 0.5 pad 1.02)
  Top 0.406: Q30.G 74.3,46.99 70.48,50.8 v6.99,50.8
  Bottom 0.406: R51.1 v6.99,50.8 R34.1 Q34.D 8.26,25.4 8.26,20.95 R35.1
D15  (via drill 0.5 pad 1.02)
  Top 0.406: v61.59,38.1 v1.91,38.1
  Bottom 0.406: J1.19 43.81,82.55 45.09,81.28 59.69,81.28 61.59,79.38 v61.59,38.1 61.59,33.66 67.31,27.94 67.31,23.5 68.58,22.23 74.3,22.23 78.11,26.04 J3.3 80.01,24.77 81.92,24.77 82.55,24.13 82.55,22.23 J3.7 J3.10 | v1.91,38.1 Q35.G
D15_N
  Bottom 0.406: Q35.D R36.1 3.17,69.22 R37.1
GND  (via drill 0.5 pad 1.02)
  Top 0.406: Q30.S 85.72,46.99 89.53,46.99 Q31.S | v67.31,17.78 67.31,24.13
  Top 0.61: Q35.S Q34.S Q33.S Q32.S Q25.S Q24.S Q21.S Q20.S Q17.S Q16.S Q15.S Q14.S Q7.S Q6.S Q2.S Q1.S Q37.S 67.31,24.13 C1.2 | Q30.S 73.66,45.72 v71.12,48.26
  Bottom 0.406: Q18.S 88.27,53.34 Q13.S 89.53,53.34 Q5.S Q19.S 90.81,48.26 Q31.S | Q36.S 79.38,9.53 79.38,14.61 78.74,15.24 69.85,15.24 v67.31,17.78
  Bottom 0.61: J1.1 20.32,84.45 19.05,85.72 19.05,88.27 19.68,88.9 31.11,88.9 | 31.11,88.9 J1.10 J1.11 | 31.11,88.9 43.81,88.9 J1.20 44.45,87 45.72,85.72 45.72,83.19 46.35,82.55 60.33,82.55 66.67,88.9 71.12,88.9 | J2.20 25.4,1.91 36.2,1.91 | 36.2,1.91 J2.10 J2.11 33.66,10.79 32.07,12.38 32.07,18.73 33.66,20.32 Q17.S | J2.1 46.99,6.35 48.26,5.08 48.26,1.91 36.2,1.91 | 71.12,88.9 77.47,88.9 TP1.P$1 C2.2 | C1.2 71.12,26.04 v71.12,48.26 71.12,88.9
LSB_OR
  Bottom 0.406: Q3.D R5.1 80.33,66.36 80.64,66.67 87,66.67 95.25,59.05 95.25,56.52 Q5.G
MSB_OR
  Bottom 0.406: Q18.G 75.56,49.53 74.3,48.26 74.3,40.01 | 74.3,40.01 74.3,36.2 R25.1 | Q22.D 80.64,39.37 80.01,40.01 74.3,40.01
N$1
  Top 0.406: R24.2 D11.K
N$2
  Bottom 0.406: Q19.D 97.16,49.53 | 97.16,49.53 R20.1 | R8.1 97.16,41.27 97.16,49.53
N$3
  Top 0.406: R22.2 34.92,17.14 34.29,16.51 31.11,16.51 D10.K
N$4
  Top 0.406: R41.2 30.48,71.12 30.48,73.03 29.84,73.66 26.67,73.66 D20.K
N$5
  Bottom 0.406: Q22.S 79.38,36.2 81.28,36.2 Q23.D
N$6
  Top 0.406: R29.2 D13.K
N$7
  Top 0.406: R27.2 27.3,17.14 26.67,16.51 23.5,16.51 D12.K
N$8
  Top 0.406: R39.2 25.4,68.58 D19.K
N$9
  Top 0.406: D22.K 19.05,73.66 22.23,73.66 22.86,73.03 22.86,71.12 R45.2
N$10
  Top 0.406: R43.2 17.78,68.58 D21.K
N$11
  Top 0.406: Q23.S 86.36,37.47 Q26.D
N$12
  Top 0.406: Q27.D 85.09,41.27 Q26.S
N$13
  Top 0.406: R31.2 19.68,17.14 19.05,16.51 15.88,16.51 D14.K
N$14
  Top 0.406: R33.2 D15.K
N$15
  Top 0.406: R35.2 12.06,17.14 11.43,16.51 8.26,16.51 D16.K
N$16
  Top 0.406: R37.2 7.62,71.12 7.62,73.03 6.99,73.66 3.81,73.66 D17.K
N$17
  Top 0.406: R47.2 10.16,68.58 D23.K
N$18
  Top 0.406: J3.5 82.55,22.23 82.55,19.68 83.19,19.05 101.6,19.05 102.23,18.41 TP8.P$1
N$19
  Top 0.406: R49.2 15.24,71.12 15.24,73.03 14.61,73.66 11.43,73.66 D24.K
N$20
  Top 0.406: R51.2 2.54,68.58 D25.K
N$21
  Bottom 0.406: D4.K 102.87,48.26 R8.2
N$22
  Top 0.406: Q19.G 90.81,50.8 89.53,52.07 87.63,52.07 87,51.44 87,49.53 Q18.D
  Bottom 0.406: R7.1 94.61,44.45 Q31.D Q19.G 93.34,52.07 Q5.D 95.89,54.61 95.89,58.42 97.16,59.69 98.42,59.69 TP4.P$1
N$23
  Top 0.406: R4.2 D2.K
N$24
  Top 0.406: R2.2 65.41,17.14 64.77,16.51 61.59,16.51 D1.K
N$26
  Top 0.406: R46.2 60.96,71.12 60.96,73.03 60.33,73.66 57.15,73.66 D28.K
N$27
  Bottom 0.406: Q3.S 81.92,62.23 Q4.D
N$28
  Top 0.406: R11.2 D5.K
N$29
  Top 0.406: R9.2 57.78,17.14 57.15,16.51 53.98,16.51 D3.K
N$30
  Top 0.406: R42.2 D27.K
N$31
  Top 0.406: R54.2 53.34,71.12 53.34,73.03 52.7,73.66 49.53,73.66 D30.K
N$32
  Top 0.406: R50.2 48.26,68.58 D29.K
N$33
  Bottom 0.406: Q8.D Q4.S
N$34
  Bottom 0.406: Q8.S 87.63,64.77 Q9.D
N$35
  Top 0.406: R13.2 50.16,17.14 49.53,16.51 46.35,16.51 D6.K
N$36
  Top 0.406: R15.2 D7.K
N$37
  Top 0.406: R17.2 42.55,17.14 41.91,16.51 38.73,16.51 D8.K
N$38
  Top 0.406: R19.2 D9.K
N$39
  Top 0.406: R56.2 40.64,68.58 D31.K
N$40
  Top 0.406: R58.2 45.72,71.12 45.72,73.03 45.09,73.66 41.91,73.66 D32.K
N$41
  Top 0.406: R60.2 33.02,68.58 D33.K
N$42
  Top 0.406: R62.2 38.1,71.12 38.1,73.03 37.47,73.66 34.29,73.66 D34.K
N$43
  Bottom 0.406: Q9.S 89.53,60.33 92.08,60.33 93.98,58.42 93.98,57.15 93.34,56.52 Q10.D
N$44
  Bottom 0.406: Q11.D 85.72,57.78 90.17,57.78 Q10.S
N$45
  Bottom 0.406: Q11.S Q12.D
N$46
  Bottom 0.406: Q12.S 86.36,52.7 86.36,55.88 87,56.52 Q13.D
N$47
  Bottom 0.406: Q27.S 82.55,40.01 85.09,40.01 85.72,40.64 Q28.D
N$48
  Top 0.406: Q28.S Q29.D
N$49
  Bottom 0.406: Q30.D Q29.S
N$51
  Bottom 0.406: D18.K 74.3,10.79 R38.2
N$52
  Bottom 0.406: R38.1 Q36.D
N$53
  Top 0.406: R44.2 55.88,68.58 D35.K
N$58
  Bottom 0.406: J3.8 84.45,22.23 TP7.P$1
RIGHT_0
  Top 0.406: J3.1 80.01,22.23 80.01,24.77 J3.6
  Bottom 0.406: Q37.G 62.87,16.51 | 62.87,16.51 62.87,10.79 60.33,8.26 45.72,8.26 45.09,7.62 45.09,5.08 J2.2 | J3.1 68.58,20.95 66.04,18.41 66.04,16.51 62.87,16.51 | J3.6 82.55,27.3 85.09,27.3 J3.12
RIGHT_0__N
  Bottom 0.406: R42.1 65.41,25.4 Q37.D R40.1
VARYING_BIT
  Bottom 0.406: Q31.G 92.08,45.09 93.34,43.81 93.34,26.04 90.81,23.5 J3.11

### Text on the board
tPlace: +5V | 0V | F | E | D | C | B | A | 9 | 8 | 7 | 6 | 5 | 4 | 3 | 2 | 1 | 0 | SHIFT_LEFT_RIGHT_1 | James Newman | Is Zero | R | L | MSbit | F | E | D | C | B | A | 9 | 8 | 7 | 6 | 5 | 4 | 3 | 2 | 1 | 0 | LSbit | Shift / Input